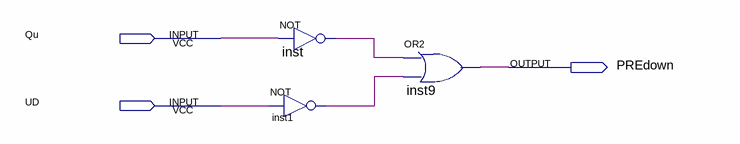
[diagram p0: schematic sheet]
// Quartus schematic PREdown.bdf as structural Verilog: 3 symbols, 3 pins
module PREdown (
  input  Qu,
  input  UD,
  output PREdown
);

  wire inst1_out, inst_out;

  not inst (inst_out, Qu);
  not inst1 (inst1_out, UD);
  or inst9 (PREdown, inst_out, inst1_out);
endmodule
